# Altium schematic sheet A1-A1 Switches Control Logic.SchDoc: A1-A1 Switches Control Logic
size D; DrawnBy: C. Lewis; Engineer: C. Lewis; Address1: 4650 NORRIS CANYON RD.; Address2: SAN RAMON, CA 94583; DocumentNumber: 35133; Revision: D; SheetNumber: 3; SheetTotal: 20
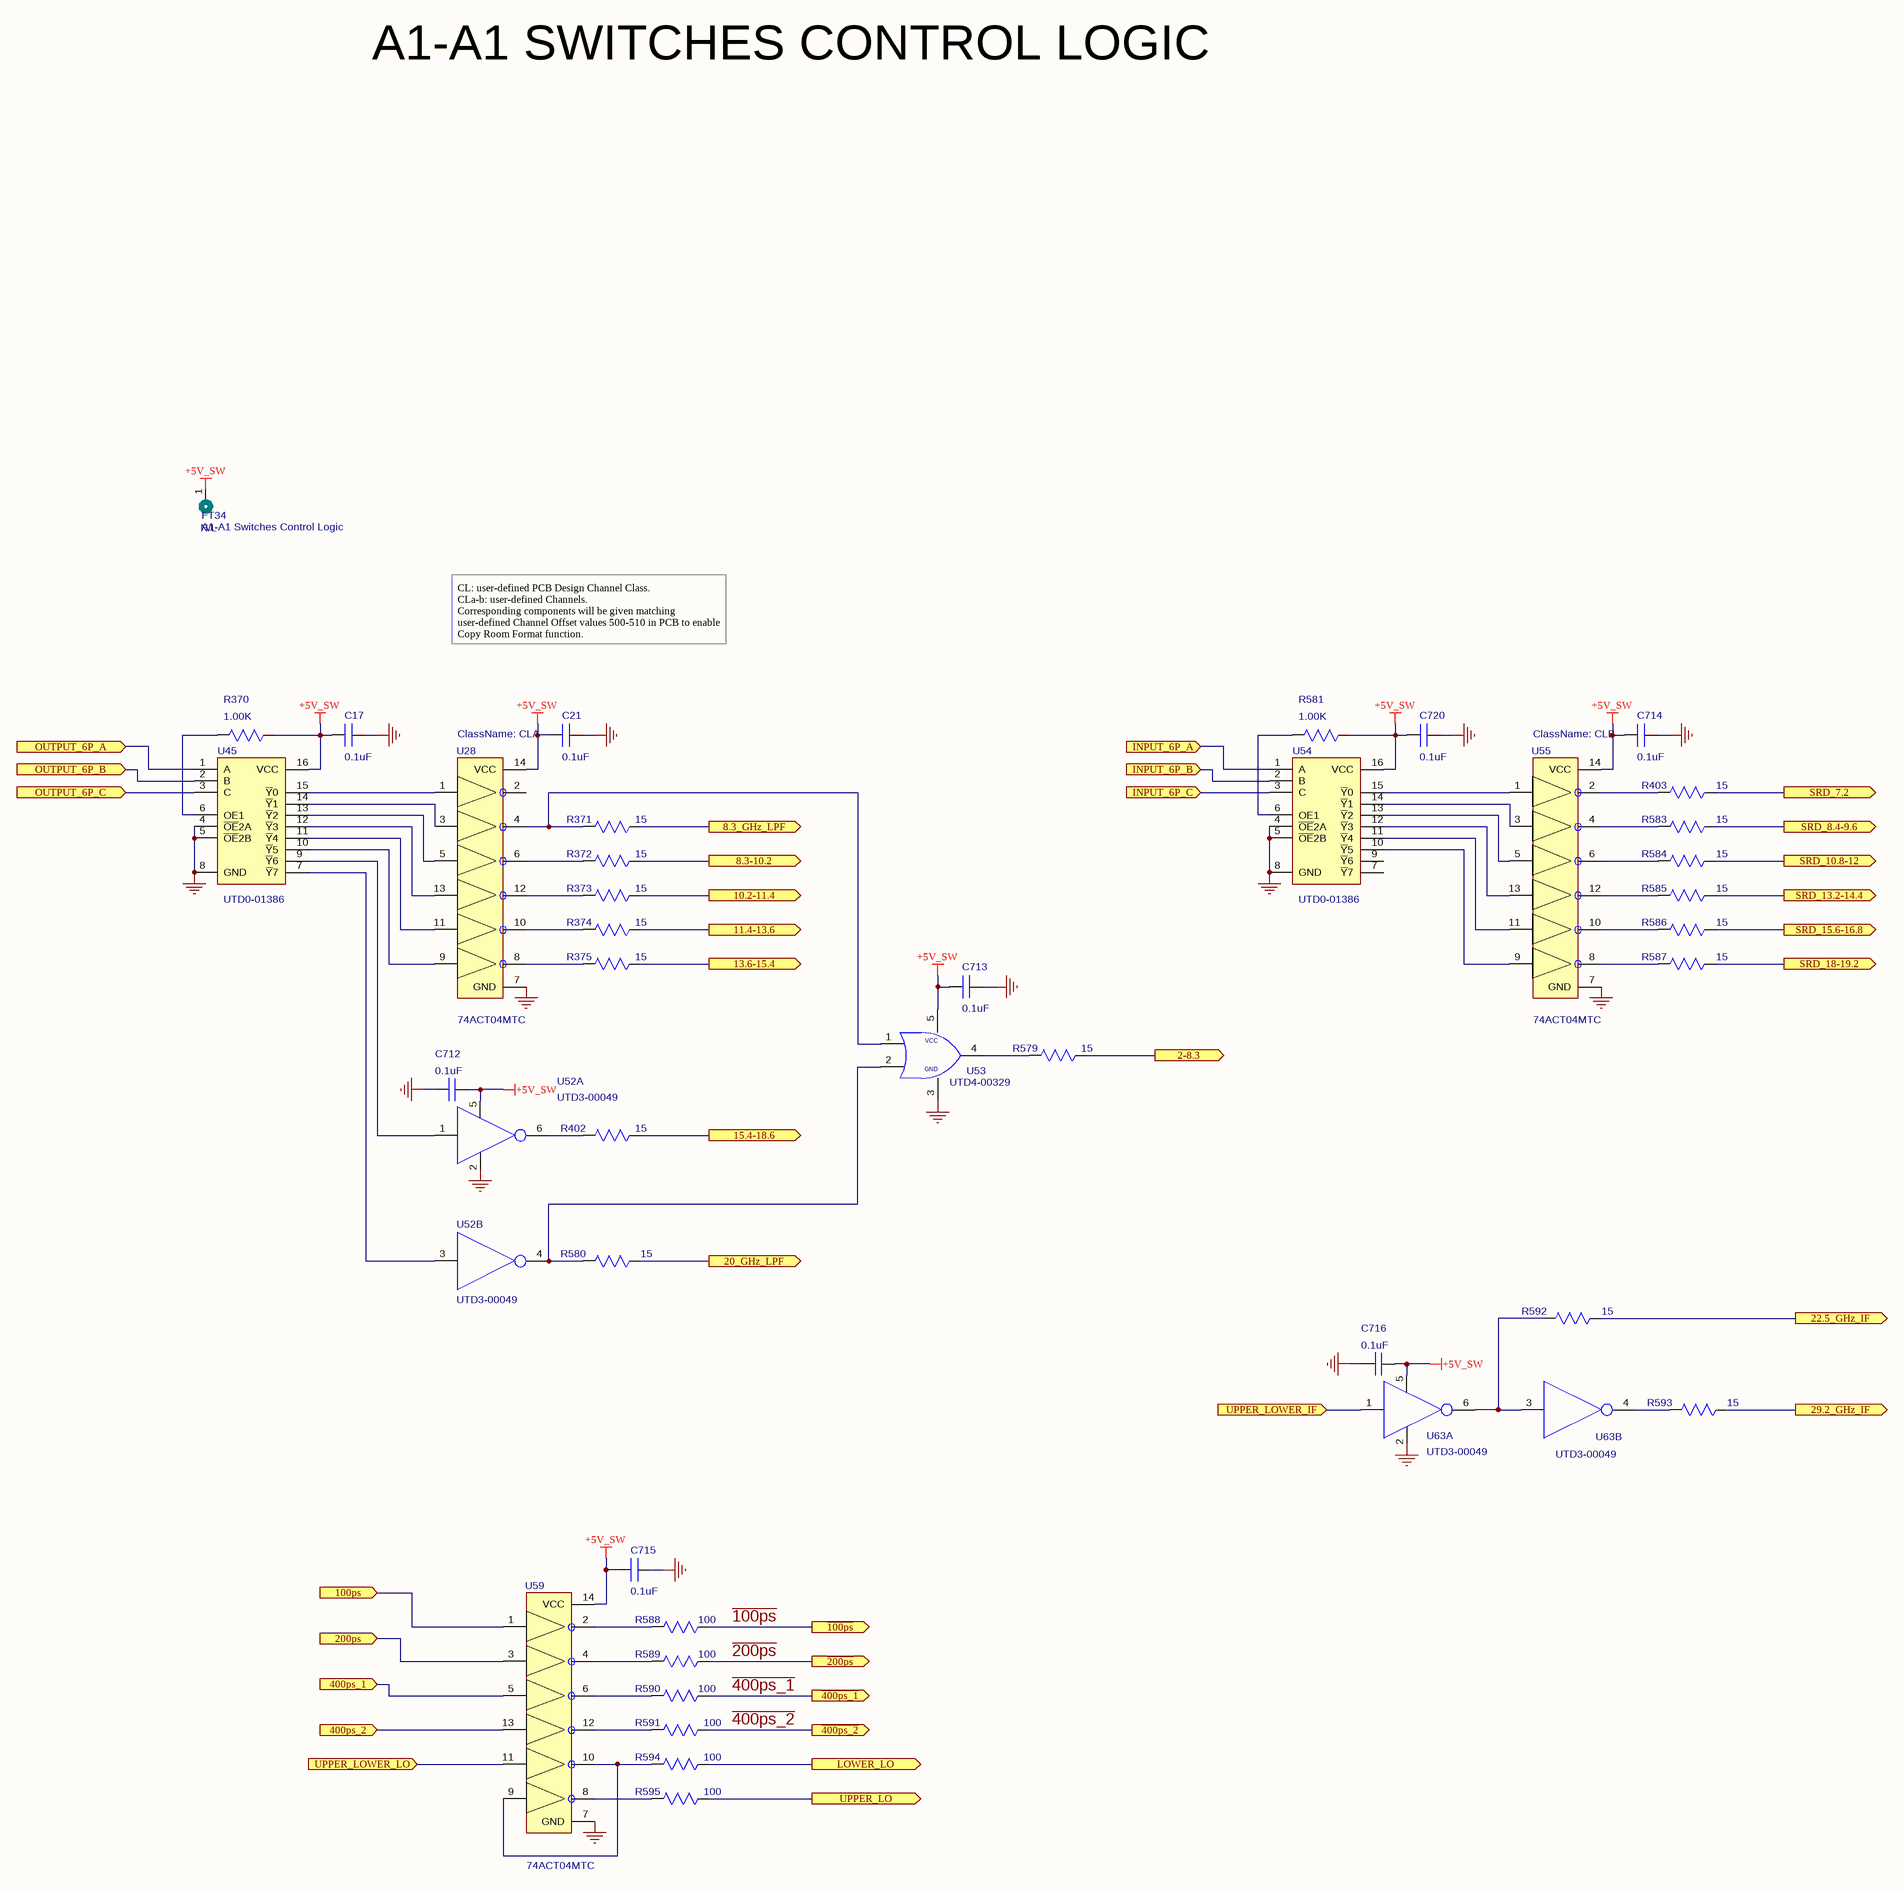
[diagram p0: A1-A1 Switches Control Logic.SchDoc]

## Parts
C17  value 0.1uF  [CAP-0603-H035-N]  (hidden comment: .1UF;10%;X7R;16V;CHIP;0603)
C21  value 0.1uF  [CAP-0603-H035-N]  (hidden comment: .1UF;10%;X7R;16V;CHIP;0603)
C712  value 0.1uF  [CAP-0603-H035-N]  (hidden comment: .1UF;10%;X7R;16V;CHIP;0603)
C713  value 0.1uF  [CAP-0603-H035-N]  (hidden comment: .1UF;10%;X7R;16V;CHIP;0603)
C714  value 0.1uF  [CAP-0603-H035-N]  (hidden comment: .1UF;10%;X7R;16V;CHIP;0603)
C715  value 0.1uF  [CAP-0603-H035-N]  (hidden comment: .1UF;10%;X7R;16V;CHIP;0603)
C716  value 0.1uF  [CAP-0603-H035-N]  (hidden comment: .1UF;10%;X7R;16V;CHIP;0603)
C720  value 0.1uF  [CAP-0603-H035-N]  (hidden comment: .1UF;10%;X7R;16V;CHIP;0603)
FT34  A1-A1 Switches Control Logic  NoLoad: N/L  [FromToNode_ML2]  (net tie, no BOM)
R370  value 1.00K  [RES-0402-N]  (hidden comment: 1.0K OHMS;.06W;1%;200PPM;FILM;CHIP;0402)
R371  value 15  [RES-0402-N]  (hidden comment: 15 OHMS;.06W;1%;200PPM;FILM;CHIP;0402)
R372  value 15  [RES-0402-N]  (hidden comment: 15 OHMS;.06W;1%;200PPM;FILM;CHIP;0402)
R373  value 15  [RES-0402-N]  (hidden comment: 15 OHMS;.06W;1%;200PPM;FILM;CHIP;0402)
R374  value 15  [RES-0402-N]  (hidden comment: 15 OHMS;.06W;1%;200PPM;FILM;CHIP;0402)
R375  value 15  [RES-0402-N]  (hidden comment: 15 OHMS;.06W;1%;200PPM;FILM;CHIP;0402)
R402  value 15  [RES-0402-N]  (hidden comment: 15 OHMS;.06W;1%;200PPM;FILM;CHIP;0402)
R403  value 15  [RES-0402-N]  (hidden comment: 15 OHMS;.06W;1%;200PPM;FILM;CHIP;0402)
R579  value 15  [RES-0402-N]  (hidden comment: 15 OHMS;.06W;1%;200PPM;FILM;CHIP;0402)
R580  value 15  [RES-0402-N]  (hidden comment: 15 OHMS;.06W;1%;200PPM;FILM;CHIP;0402)
R581  value 1.00K  [RES-0402-N]  (hidden comment: 1.0K OHMS;.06W;1%;200PPM;FILM;CHIP;0402)
R583  value 15  [RES-0402-N]  (hidden comment: 15 OHMS;.06W;1%;200PPM;FILM;CHIP;0402)
R584  value 15  [RES-0402-N]  (hidden comment: 15 OHMS;.06W;1%;200PPM;FILM;CHIP;0402)
R585  value 15  [RES-0402-N]  (hidden comment: 15 OHMS;.06W;1%;200PPM;FILM;CHIP;0402)
R586  value 15  [RES-0402-N]  (hidden comment: 15 OHMS;.06W;1%;200PPM;FILM;CHIP;0402)
R587  value 15  [RES-0402-N]  (hidden comment: 15 OHMS;.06W;1%;200PPM;FILM;CHIP;0402)
R588  value 100  [RES-0402-N]  (hidden comment: 100 OHMS; 1%; .1W; 100PPM; FILM; CHIP; 0402)
R589  value 100  [RES-0402-N]  (hidden comment: 100 OHMS; 1%; .1W; 100PPM; FILM; CHIP; 0402)
R590  value 100  [RES-0402-N]  (hidden comment: 100 OHMS; 1%; .1W; 100PPM; FILM; CHIP; 0402)
R591  value 100  [RES-0402-N]  (hidden comment: 100 OHMS; 1%; .1W; 100PPM; FILM; CHIP; 0402)
R592  value 15  [RES-0402-N]  (hidden comment: 15 OHMS;.06W;1%;200PPM;FILM;CHIP;0402)
R593  value 15  [RES-0402-N]  (hidden comment: 15 OHMS;.06W;1%;200PPM;FILM;CHIP;0402)
R594  value 100  [RES-0402-N]  (hidden comment: 100 OHMS; 1%; .1W; 100PPM; FILM; CHIP; 0402)
R595  value 100  [RES-0402-N]  (hidden comment: 100 OHMS; 1%; .1W; 100PPM; FILM; CHIP; 0402)
U28  M_PN: 74ACT04MTC  ClassName: CLA  [TSOP65P640X120-14L]  (hidden comment: 74ACT04MTC HEX INVERTER;SMT;TSSOP-14)
U45  UTD0-01386  [SOIC16_MS-012]
U52  INVERTER;DUAL;1.65-5.5V SUP;2NS TPD;SC70-6  [SOT-363_419B]  (value not drawn)  (parts A,B of 2)
U53  M74VHC1GT32DFT1G SGL OR SOT-353 RoHS  [SOT-353_ONSEMI]  (value not drawn)
U54  UTD0-01386  [SOIC16_MS-012]
U55  M_PN: 74ACT04MTC  ClassName: CLB  [TSOP65P640X120-14L]  (hidden comment: 74ACT04MTC HEX INVERTER;SMT;TSSOP-14)
U59  M_PN: 74ACT04MTC  [TSOP65P640X120-14L]  (hidden comment: 74ACT04MTC HEX INVERTER;SMT;TSSOP-14)
U63  INVERTER;DUAL;1.65-5.5V SUP;2NS TPD;SC70-6  [SOT-363_419B]  (value not drawn)  (parts A,B of 2)

## Ports
2-8.3, 8.3-10.2, 8.3_GHz_LPF, 10.2-11.4, 11.4-13.6, 13.6-15.4, 15.4-18.6, 20_GHz_LPF, 22.5_GHz_IF, 29.2_GHz_IF, 100ps, 200ps, 400ps_1, 400ps_2, INPUT_6P_A, INPUT_6P_B, INPUT_6P_C, LOWER_LO, OUTPUT_6P_A, OUTPUT_6P_B, OUTPUT_6P_C, SRD_7.2, SRD_8.4-9.6, SRD_10.8-12, SRD_13.2-14.4, SRD_15.6-16.8, SRD_18-19.2, UPPER_LO, UPPER_LOWER_IF, UPPER_LOWER_LO, ~{100ps}, ~{200ps}, ~{400ps_1}, ~{400ps_2}

## Nets
+5V_SW: C17.1 C21.1 C712.1 C713.1 C714.1 C715.1 C716.1 C720.1 FT34.1 R370.2 R581.2 U28.14(VCC) U45.16(VCC) U52.5(V+) U53.5(VCC) U54.16(VCC) U55.14(VCC) U59.14(VCC) U63.5(V+)
GND: C17.2 C21.2 C712.2 C713.2 C714.2 C715.2 C716.2 C720.2 U28.7(GND) U45.4(~{OE}2A) U45.5(~{OE}2B) U45.8(GND) U52.2(V-) U53.3(GND) U54.4(~{OE}2A) U54.5(~{OE}2B) U54.8(GND) U55.7(GND) U59.7(GND) U63.2(V-)
~{100ps}: R588.2 ; port ~{100ps}
2-8.3: R579.2 ; port 2-8.3
~{200ps}: R589.2 ; port ~{200ps}
~{400ps_1}: R590.2 ; port ~{400ps_1}
~{400ps_2}: R591.2 ; port ~{400ps_2}
8.3-10.2: R372.2 ; port 8.3-10.2
8.3_GHz_LPF: R371.2 ; port 8.3_GHz_LPF
10.2-11.4: R373.2 ; port 10.2-11.4
11.4-13.6: R374.2 ; port 11.4-13.6
13.6-15.4: R375.2 ; port 13.6-15.4
15.4-18.6: R402.2 ; port 15.4-18.6
20_GHz_LPF: R580.2 ; port 20_GHz_LPF
22.5_GHz_IF: R592.2 ; port 22.5_GHz_IF
29.2_GHz_IF: R593.2 ; port 29.2_GHz_IF
100ps: U59.1 ; port 100ps
200ps: U59.3 ; port 200ps
400ps_1: U59.5 ; port 400ps_1
400ps_2: U59.13 ; port 400ps_2
INPUT_6P_A: U54.1(A) ; port INPUT_6P_A
INPUT_6P_B: U54.2(B) ; port INPUT_6P_B
INPUT_6P_C: U54.3(C) ; port INPUT_6P_C
LOWER_LO: R594.2 ; port LOWER_LO
OUTPUT_6P_A: U45.1(A) ; port OUTPUT_6P_A
OUTPUT_6P_B: U45.2(B) ; port OUTPUT_6P_B
OUTPUT_6P_C: U45.3(C) ; port OUTPUT_6P_C
SRD_7.2: R403.2 ; port SRD_7.2
SRD_8.4-9.6: R583.2 ; port SRD_8.4-9.6
SRD_10.8-12: R584.2 ; port SRD_10.8-12
SRD_13.2-14.4: R585.2 ; port SRD_13.2-14.4
SRD_15.6-16.8: R586.2 ; port SRD_15.6-16.8
SRD_18-19.2: R587.2 ; port SRD_18-19.2
UPPER_LO: R595.2 ; port UPPER_LO
UPPER_LOWER_IF: U63.1(IN) ; port UPPER_LOWER_IF
UPPER_LOWER_LO: U59.11 ; port UPPER_LOWER_LO
NetR370_1: R370.1 U45.6(OE1)
NetR371_1: R371.1 U28.4 U53.1(B)
NetR372_1: R372.1 U28.6
NetR373_1: R373.1 U28.12
NetR374_1: R374.1 U28.10
NetR375_1: R375.1 U28.8
NetR402_1: R402.1 U52.6(OUT)
NetR403_1: R403.1 U55.2
NetR579_1: R579.1 U53.4(Y)
NetR580_1: R580.1 U52.4(OUT) U53.2(A)
NetR581_1: R581.1 U54.6(OE1)
NetR583_1: R583.1 U55.4
NetR584_1: R584.1 U55.6
NetR585_1: R585.1 U55.12
NetR586_1: R586.1 U55.10
NetR587_1: R587.1 U55.8
NetR588_1: R588.1 U59.2
NetR589_1: R589.1 U59.4
NetR590_1: R590.1 U59.6
NetR591_1: R591.1 U59.12
NetR592_1: R592.1 U63.3(IN) U63.6(OUT)
NetR593_1: R593.1 U63.4(OUT)
NetR594_1: R594.1 U59.9 U59.10
NetR595_1: R595.1 U59.8
NetU28_1: U28.1 U45.15(~{Y}0)
NetU28_3: U28.3 U45.14(~{Y}1)
NetU28_5: U28.5 U45.13(~{Y}2)
NetU28_9: U28.9 U45.10(~{Y}5)
NetU28_11: U28.11 U45.11(~{Y}4)
NetU28_13: U28.13 U45.12(~{Y}3)
NetU45_7: U45.7(~{Y}7) U52.3(IN)
NetU45_9: U45.9(~{Y}6) U52.1(IN)
NetU54_10: U54.10(~{Y}5) U55.9
NetU54_11: U54.11(~{Y}4) U55.11
NetU54_12: U54.12(~{Y}3) U55.13
NetU54_13: U54.13(~{Y}2) U55.5
NetU54_14: U54.14(~{Y}1) U55.3
NetU54_15: U54.15(~{Y}0) U55.1

Not connected (* = marked no-connect by the designer): U28 2; U54 7(~{Y}7) 9(~{Y}6)

## Notes on the sheet
- A1-A1 SWITCHES CONTROL LOGIC
- CL: user-defined PCB Design Channel Class.
  CLa-b: user-defined Channels.
  Corresponding components will be given matching user-defined Channel Offset values 500-510 in PCB to enable Copy Room Format function.
- Title
- Sheet Title
- PRINTED DOCUMENT IS CONSIDERED UNCONTROLLED. VERIFY REVISION IN PLM SYSTEM.
- THIS DOCUMENT CONTAINS PROPRIETARY INFORMATION. DESIGN RIGHTS BELONG TO GIGA-TRONICS AND MAY NOT BE REPRODUCED WITHOUT WRITTEN AUTHORIZATION FOR ANY REASON EXCEPT CALIBRATION, OPERATION AND MAINTENANCE.
- Size
- CAGE CODE
- Filename
- D
- Document Number
- 58900
- Date
- Sheet
- Rev
- of

## Library data of the parts
C17 C21 C712-C716 C720 = CK45-04100: Approved: CL; NoLoad: .; MFGR: ANY; level: 1; line_number: 105; ModifyDate: 02/22/12; G_PN: CK45-04100; M_PN: ANY; item_number: CK45-04100
  C17 C21: ClassName: CLA
  C714 C720: ClassName: CLB
FT34 = FromToNode: level: 1; Approved: *; G_PN: *; MFGR: *; Value: *
R370 R581 = RK35-11000: Approved: CL; NoLoad: .; MFGR: ANY; level: 1; line_number: 1025; G_PN: RK35-11000; ModifyDate: 02/22/12; M_PN: ANY; item_number: RK35-11000
  R370: ClassName: CLA
  R581: ClassName: CLB
R371-R375 R402 R403 R579 R580 R583-R587 R592 R593 = RK35-00150: Approved: CL; NoLoad: .; MFGR: ANY; level: 1; line_number: 915; G_PN: RK35-00150; ModifyDate: 02/22/13; M_PN: ANY; item_number: RK35-00150
  R371-R375: ClassName: CLA
  R403 R583-R587: ClassName: CLB
R588-R591 R594 R595 = RK35-01000: Approved: CL; NoLoad: .; MFGR: ANY; level: 1; line_number: 960; G_PN: RK35-01000; ModifyDate: 02/22/12; M_PN: ANY; item_number: RK35-01000
U28 U55 U59 = UTD4-00046: MFGR: Fairchild; NoLoad: .; Approved: NM; level: 1; line_number: 1175; Value: *; ModifyDate: 10/27/12; G_PN: UTD4-00046; item_number: UTD4-00046
U45 U54 = UTD0-01386: 3 TO 8 DECODER/DEMULTIPLEXER;74ACT138 LOGIC;SO-16; Approved: NM; MFGR: FAIRCHILD; M_PN: 74ACT138SC; NoLoad: .; level: 1; line_number: 1165; G_PN: UTD0-01386; ModifyDate: 11/8/12; Value: *; item_number: UTD0-01386
  U45: ClassName: CLA
  U54: ClassName: CLB
U52 U63 = UTD3-00049: Value: NL27WZ04DFT2G; NoLoad: .; Approved: CL; MFGR: ON SEMI; level: 1; line_number: 1250; ModifyDate: 02/22/12; M_PN: NL27WZ04DFT2G; G_PN: UTD3-00049; item_number: UTD3-00049
U53 = UTD4-00329: NoLoad: .; Approved: CL; MFGR: ON SEMI; level: 1; line_number: 1220; Value: M74VHC1GT32DFT1G; G_PN: UTD4-00329; ModifyDate: 6/21/14; M_PN: M74VHC1GT32DFT1G; item_number: UTD4-00329